# EAGLE design Picobot_14 (EAGLE 6.5.0)
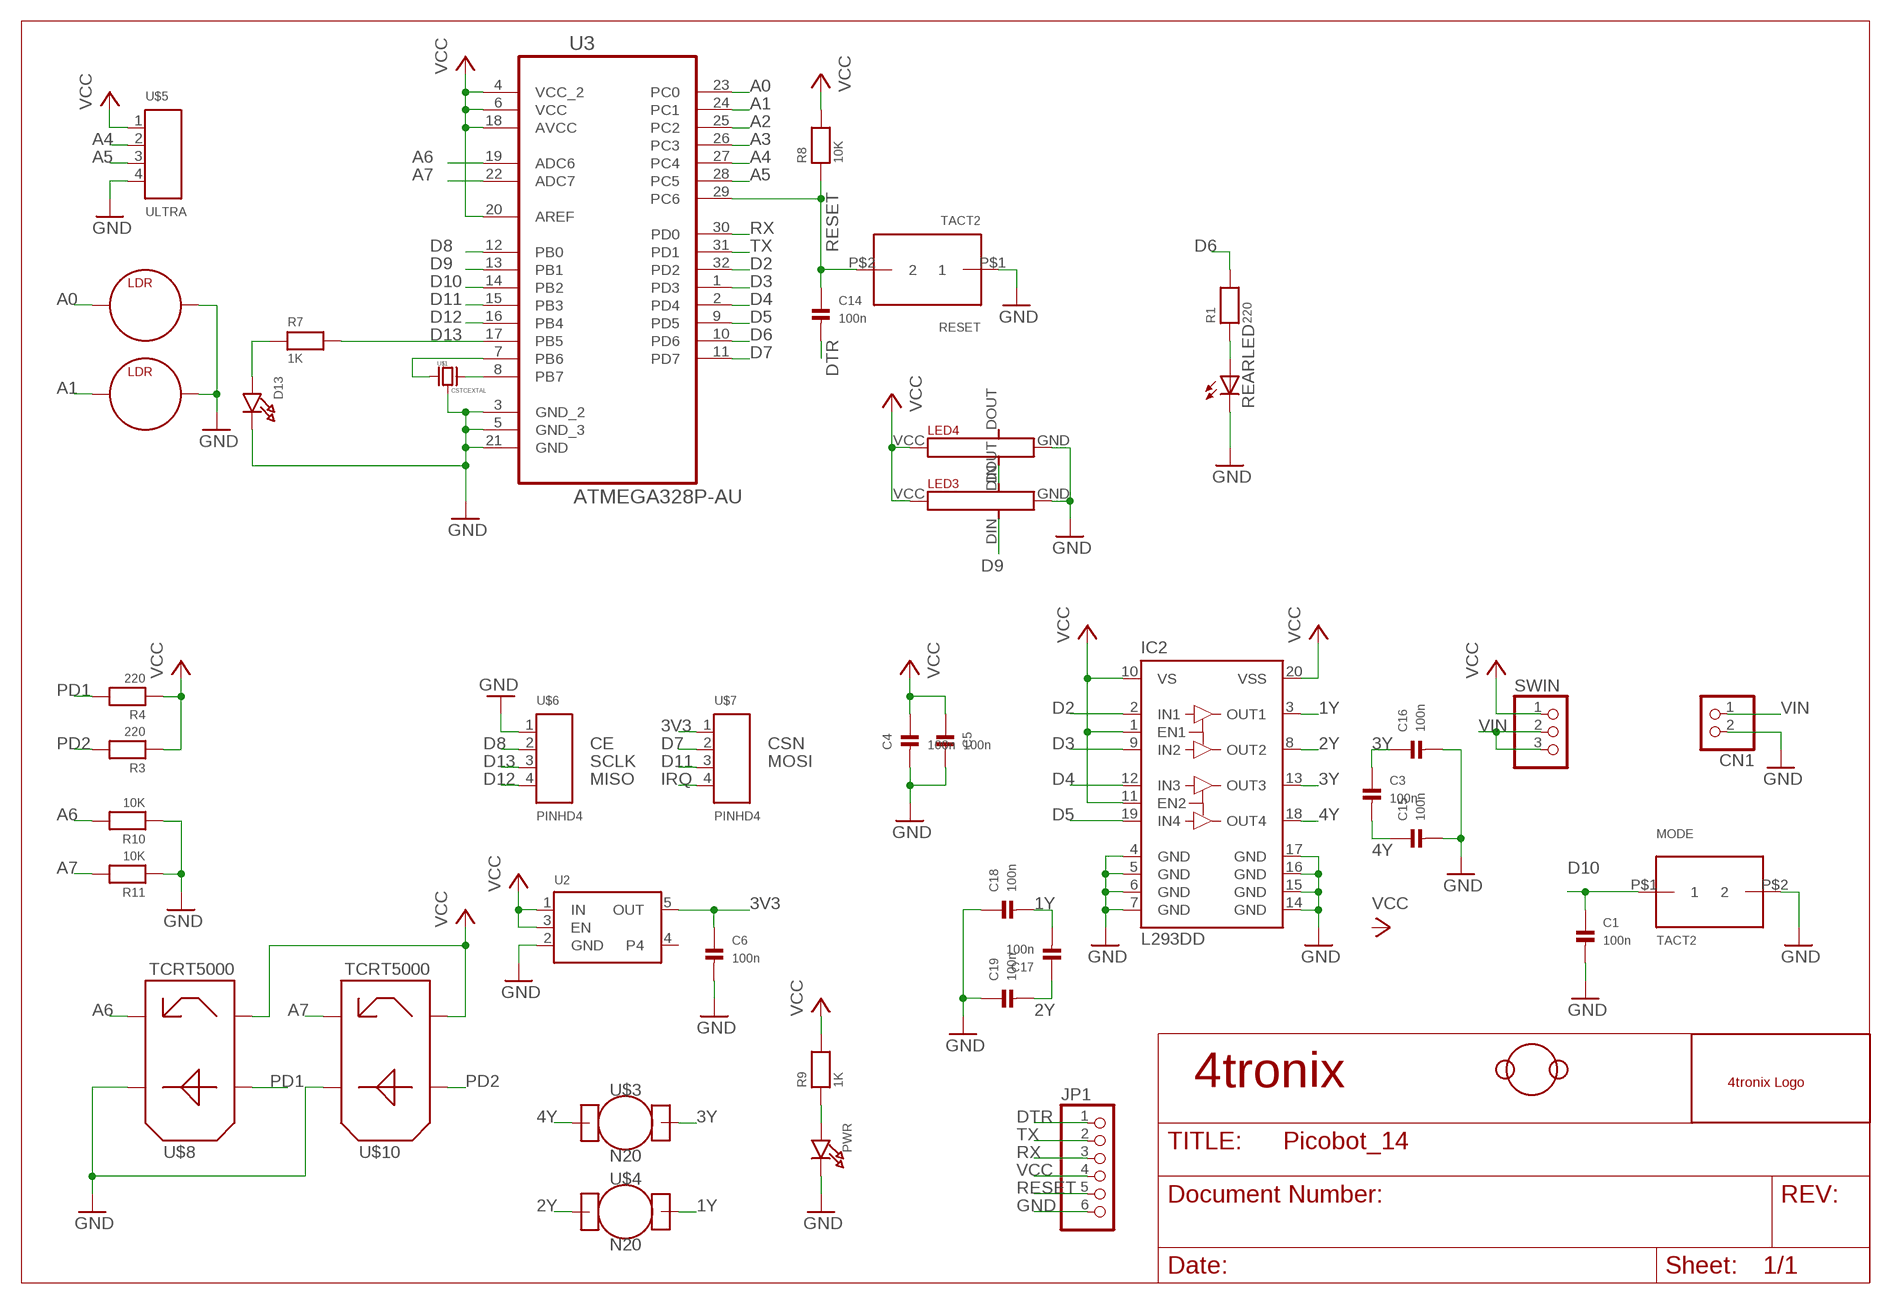
[diagram p0: schematic, sheet 1]

## Parts
C1  100n  CAP_CERAMIC_0603MP  [_0603MP]
C3  100n  CAP_CERAMIC_0603MP  [_0603MP]
C4  100n  CAP_CERAMIC_0603MP  [_0603MP]
C5  100n  CAP_CERAMIC_0603MP  [_0603MP]
C6  100n  CAP_CERAMIC_0603MP  [_0603MP]
C14  100n  CAP_CERAMIC_0603MP  [_0603MP]
C15  100n  CAP_CERAMIC_0603MP  [_0603MP]
C16  100n  CAP_CERAMIC_0603MP  [_0603MP]
C17  100n  CAP_CERAMIC_0603MP  [_0603MP]
C18  100n  CAP_CERAMIC_0603MP  [_0603MP]
C19  100n  CAP_CERAMIC_0603MP  [_0603MP]
CN1  JST_2PIN-THM  [JST-PH-2-THM]
D13  LED0805_NOOUTLINE  [CHIPLED_0805_NOOUTLINE]
IC2  L293DD  [SO20]
JP1  PINHD-1X6CB  [1X06-CLEANBIG]
LDR1  LDR  [LDR]
LDR2  LDR  [LDR]
LED3  WS2812B  [WS2812B]
LED4  WS2812B  [WS2812B]
MODE  TACT2  [TACT2-PIN]
PWR  LED0805_NOOUTLINE  [CHIPLED_0805_NOOUTLINE]
R1  220  RESISTOR0603MINI  [0603-MINI]
R3  220  RESISTOR0603MINI  [0603-MINI]
R4  220  RESISTOR0603MINI  [0603-MINI]
R7  1K  RESISTOR0603MINI  [0603-MINI]
R8  10K  RESISTOR0603MINI  [0603-MINI]
R9  1K  RESISTOR0603MINI  [0603-MINI]
R10  10K  RESISTOR0603MINI  [0603-MINI]
R11  10K  RESISTOR0603MINI  [0603-MINI]
REARLED  LED3MM  [LED3MM]
RESET  TACT2  [TACT2-PIN]
SWIN  PINHD-1X3CB  [1X03-CLEANBIG]
U2  VREG_SOT23-5  [SOT23-5]
U3  ATMEGA328P-AU  [QFP80P900X900X120-32N]
U$1  CSTCEXTAL  [CSTCEXTAL]
U$2  LOGO  [LOGO]
U$3  N20  [N20]
U$4  N20  [N20]
U$5  ULTRA  PINHD4  [PINHD4]
U$6  PINHD4  [PINHD4]
U$7  PINHD4  [PINHD4]
U$8  TCRT5000  [TCRT5000]
U$9  DFRBALL  [DFRBALL]
U$10  TCRT5000  [TCRT5000]

## Nets
1Y: C17.2 C18.2 IC2.3(OUT1) U$4.MTRA(MTRB)
2Y: C17.1 C19.2 IC2.8(OUT2) U$4.MTRB(MTRA)
3V3: C6.1 U2.5(OUT) U$7.1
3Y: C3.1 C16.1 IC2.13(OUT3) U$3.MTRA(MTRB)
4Y: C3.2 C15.1 IC2.18(OUT4) U$3.MTRB(MTRA)
A0: LDR1.A U3.23(PC0)
A1: LDR2.A U3.24(PC1)
A2: U3.25(PC2)
A3: U3.26(PC3)
A4: U3.27(PC4) U$5.2
A5: U3.28(PC5) U$5.3
A6: R10.2 U3.19(ADC6) U$8.TR2
A7: R11.2 U3.22(ADC7) U$10.TR2
D2: IC2.2(IN1) U3.32(PD2)
D3: IC2.9(IN2) U3.1(PD3)
D4: IC2.12(IN3) U3.2(PD4)
D5: IC2.19(IN4) U3.9(PD5)
D6: R1.2 U3.10(PD6)
D7: U3.11(PD7) U$7.2
D8: U3.12(PB0) U$6.2
D9: LED3.DIN(DI) U3.13(PB1)
D10: C1.1 MODE.P$1 U3.14(PB2)
D11: U3.15(PB3) U$7.3
D12: U3.16(PB4) U$6.4
D13: R7.2 U3.17(PB5) U$6.3
DTR: C14.2 JP1.1
GND: C1.2 C4.2 C5.2 C6.2 C15.2 C16.2 C18.1 C19.1 CN1.2 D13.C IC2.4(GND) IC2.5(GND) IC2.6(GND) IC2.7(GND) IC2.14(GND) IC2.15(GND) IC2.16(GND) IC2.17(GND) JP1.6 LDR1.K LDR2.K LED3.GND LED4.GND MODE.P$2 PWR.C R10.1 R11.1 REARLED.K(C) RESET.P$1 U2.2(GND) U3.3(GND_2) U3.5(GND_3) U3.21(GND) U$1.G U$5.4 U$6.1 U$8.LED2 U$10.LED2
IRQ: U$7.4
N$1: D13.A R7.1
N$2: R1.1 REARLED.A
N$3: U3.7(PB6) U$1.X1
N$4: U3.8(PB7) U$1.X2
N$6: LED3.DOUT(DO) LED4.DIN(DI)
N$8: PWR.A R9.1
PD1: R4.2 U$8.LED1
PD2: R3.2 U$10.LED1
RESET: C14.1 JP1.5 R8.1 RESET.P$2 U3.29(PC6)
RX: JP1.3 U3.30(PD0)
TX: JP1.2 U3.31(PD1)
VCC: C4.1 C5.1 IC2.1(EN1) IC2.10(VS) IC2.11(EN2) IC2.20(VSS) JP1.4 LED3.VCC LED4.VCC R3.1 R4.1 R8.2 R9.2 SWIN.1 U2.1(IN) U2.3(EN) U3.4(VCC_2) U3.6(VCC) U3.18(AVCC) U3.20(AREF) U$5.1 U$8.TR1 U$10.TR1
VIN: CN1.1 SWIN.2 SWIN.3
Unconnected: LED4.DOUT(DO) U2.4

## Notes on the sheet
- CE | CSN
- SCLK | MOSI
- MISO
- 4tronix

## Library data of the parts
C1 C3-C6 C14-C19 = microbuilder:CAP_CERAMIC: Ceramic Capacitors 0402 - 0402 Surface Mount Capacitors 16pF 50V 5% [Digikey: 445-4899-2-ND] 18pF 50V 5% [Digikey: 490-1281-2-ND] 22pF 50V 5% [Digikey: 490-1283-2-ND] 68pF 50V 5% [Digikey: 490-1289-2-ND] 0.1uF 10V 10% [Digikey: 490-1318-2-ND] 1.0uF 6.3V 10% [Digikey: 490-1320-2-ND] 0603 - 0603 Surface Mount Capacitors 16 pF 50V 5% [Digikey: 445-5051-2-ND] 22 pF 50V [Digikey: PCC220ACVTR-ND] 33 pF 50V 5% [Digikey: 490-1415-1-ND] 56pF 50V 5% [Digikey: 490-1421-1-ND] 220pF 50V 5% [Digikey: 445-1285-1-ND] 680 pF 50V 2200 pF 50V 5% C0G [Digikey: 445-1297-1-ND] 5600 pF 100V 5% X7R [Digikey: 478-3711-1-ND] 0.1 µF 25V 10% [Digikey: PCC2277TR-ND] 0.22 µF 16V 10% X7R [Digikey: 445-1318-1-ND] 1.0 µF 25V 10% [Digikey: 445-5146-2-ND] 0603 - RF Specific 3pF 250V +/-0.1pF RF [Digikey: 712-1347-1-ND] 18 pF 250V 5% [Digikey: 478-3505-1-ND or 712-1322-1-ND] 56 pF 250V 5% C0G RF [Digikey: 490-4867-1-ND] 68 pF 250V RF [Digikey: 490-4868-1-ND] 0805 - 0805 Surface Mount Capacitors 220 pF 250V 2% RF Ceramic Capacitor [Digikey: 712-1398-1-ND] 1000 pF 50V 2% NP0 Ceramic Capacitor [Digikey: 478-3760-1-ND] 0.1 µF 25V 10% Ceramic Capacitor [Digikey: PCC1828TR-ND] 1.0 µF 16V 10% Ceramic Capacitor[Digikey: 490-1691-2-ND] 10.0 µF 10V 10% Ceramic Capacitor[Digikey: 709-1228-1-ND] 10.0 uF 16V 10% Ceramic Capacitor [Digikey: 478-5165-2-ND] 47 uF 6.3V 20% Ceramic Capacitor [Digikey: 587-1779-1-ND or 399-5506-1-ND] 1206 - 1206 Surface Mount Capacitors 47uF 10V 20% Ceramic Capacitor [Digikey: 490-5528-1-ND or 399-5508-1-ND or 445-6010-1-ND] 100uF 6.3V -20%, +80% Y5V Ceramic Capacitor (Digikey: 490-4512-1-ND, Mouser: 81-GRM31CF50J107ZE1L)
CN1 = adafruit:JST_2PIN: JST 2-Pin Connectors of various flavors SMT-RA (S2B-PH-SM4) 4UConnector #17311 SMT (B2B-PH-SM4) THM-RA (S2B-PH) THM (B2B-PH)
D13 PWR = microbuilder:LED: LED
IC2 = st-microelectronics:L293DD: PUSH-PULL FOUR CHANNEL DRIVER WITH DIODES Source: http://www.st.com/stonline/books/pdf/docs/1330.pdf; OC_FARNELL: unknown
JP1 = adafruit:PINHD-1X6: PIN HEADER
LDR1 LDR2 = 4tronix:LDR
LED3 LED4 = 4tronix:WS2812B: Features and Benefits  * Intelligent reverse connect protection, the power supply reverse connection does not damage the IC. * The control circuit and the LED share the only power source. Control circuit and RGB chip are integrated in a package of 5050 components, form a complete control of pixel point.  * Built-in signal reshaping circuit, after wave reshaping to the next driver, ensure wave-form distortion not accumulate.  * Built-in electric reset circuit and power lost reset circuit.  * Each pixel of the three primary color can achieve 256 brightness display, completed 16777216 color full color display, and scan frequency not less than 400Hz/s.  * Cascading port transmission signal by single line.  * Any two point the distance more than 5m transmission signal without any increase circuit.  * When the refresh rate is 30fps, cascade number are not less than1024 points.  * Send data at speeds of 800Kbps.  *The color of the light were highly consistent, cost-effective. Applications  Full-color module, Full color soft lights a lamp strip. LED decorative lighting, Indoor/outdoor LED video irregular screen. General description WS2812B is a intelligent control LED light source that the control circuit and RGB chip are integrated in a package of 5050 components. It internal include intelligent digital port data latch and signal reshaping amplification drive circuit. Also include a precision internal oscillator and a 12V voltage programmable constant curre-nt control part, effectively ensuring the pixel point light color height consistent. The data transfer protocol use single NZR communication mode. After the pixel power-on reset, the DIN port receive data from controller, the first pixel collect initial 24bit data then sent to the internal data latch, the other data which reshaping by the internal signal reshaping amplification circuit sent to the next cascade pixel through the DO port. After transmission for each pixel,the signal to reduce 24bit. pixel adopt auto reshaping transmit technology, making the pixel cascade number is not limited the signal transmission, only depend on the speed of signal transmission. LED with low driving voltage, environmental protection and energy saving, high brightness, scattering angle is large, good consistency, low power, long life and other advantages. The control chip integrated in LED above becoming more simple circuit, small volume, convenient installation. Absolute Maximum Ratings Power supply voltage: VDD +3.5V..+5.3V Input voltage: VI -0.5V..VDD+0.5V based on WS2812 from https://github.com/adafruit/Adafruit-Eagle-Library
MODE RESET = 4tronix:TACT2
R1 R3 R4 R7-R11 = microbuilder:RESISTOR: Resistors 0402 - 0402 Surface Mount Package 22 Ohm 1% 1/16W [Digikey: 311-22.0LRTR-ND] 33 Ohm 5% 1/16W 1.0K 5% 1/16W 1.5K 5% 1/16W 2.0K 1% 1/16W 10.0K 1% 1/16W [Digikey: 311-10.0KLRTR-ND] 10.0K 5% 1/16W [Digikey: RMCF0402JT10K0TR-ND] 12.1K 1% 1/16W [Digikey: 311-22.0LRTR-ND] 100.0K 5% 1/16W 0603 - 0603 Surface Mount Package 0 Ohm 1/10 Watt 1% Resistor 15 Ohm 1/10 Watt 1% Resistor 33 Ohm 1/10 Watt 1% Resistor 49.9 Ohm 1/10 Watt 1% Resistor 100 Ohm 1/10 Watt 1% Resistor 150 Ohm 1/10 Watt 1% Resistor 240 Ohm 1/10 Watt 1% Resistor 390 Ohm 1/10 Watt 1% Resistor 560 Ohm 1/10 Watt 1% Resistor 680 Ohm 1/10 Watt 1% Resistor 750 Ohm 1/10 Watt 1% Resistor 1.0K Ohm 1/10 Watt 1% Resistor 1.5K Ohm 1/10 Watt 1% Resistor 2.0K Ohm 1/10 Watt 1% Resistor 2.2K Ohm 1/10 Watt 1% Resistor 3.3K Ohm 1/10 Watt 1% Resistor 4.7K Ohm 1/10 Watt 1% Resistor 10.0K Ohm 1/10 Watt 1% Resistor 12.0K Ohm 1/10 Watt 1% Resistor 12.1K Ohm 1/10 Watt 1% Resistor 20.0K Ohm 1/10 Watt 1% Resistor 33.0K Ohm 1/10 Watt 1% Resistor 100.0K Ohm 1/10 Watt 1% Resistor 0805 - 0805 Surface Mount Package 0 Ohm 1/8 Watt 1% Resistor 33 Ohm 1/8 Watt 1% Resistor 100 Ohm 1/8 Watt 1% Resistor 150 Ohm 1/8 Watt 1% Resistor 200 Ohm 1/8 Watt 1% Resistor 240 Ohm 1/8 Watt 1% Resistor 330 Ohm 1/8 Watt 1% Resistor 390 Ohm 1/8 Watt 1% Resistor 470 Ohm 1/8 Watt 1% Resistor 1.0K Ohm 1/8 Watt 1% Resistor 1.5K Ohm 1/8 Watt 1% Resistor 2.0K Ohm 1/8 Watt 1% Resistor 4.7K Ohm 1/8 Watt 1% Resistor 5.1K Ohm 1/8 Watt 1% Resistor 5.6K Ohm 1/8 Watt 1% Resistor 10.0K Ohm 1/8 Watt 1% Resistor 22.0K Ohm 1/8 Watt 1% Resistor 33.0K Ohm 1/8 Watt 1% Resistor 100K Ohm 1/8 Watt 1% Resistor 1206 - 1206 Surface Mount Package 2012 - 2010 Surface Mount Package 0.11 Ohm 1/2 Watt 1% Resistor - Digikey: RHM.11UCT-ND
REARLED = adafruit:LED: LED
SWIN = adafruit:PINHD-1X3: PIN HEADER
U2 = microbuilder:VREG_SOT23-5: SOT23-5 Fixed Voltage Regulators To better organise some of the SOT23-5 fixed voltage regulators in this library, this new part was created. Part Current Out V Out V In V Dropout Digikey Part No. ADP121 150mA 3.3V 3.4-5.5V 0.09V @ 150mA ADP121-AUJZ33R7CT-ND ADP121 150mA 3.0V 3.1-5.5V 0.09V @ 150mA ADP121-AUJZ30R7CT-ND ADP122 300mA 3.3V 3.4-5.5V 0.085V @ 300mA ADP122AUJZ-3.3-R7CT-ND ADP1712 300mA 3.3V 3.5-5.5V 0.17V @ 300mA ADP1712AUJZ-3.3-R7TR-ND AP7311 (Low Cost) 150mA 3.3V 3.5-6V 0.15V @ 150mA AP7311-33WG-7DICT-ND LD39015M18R 150mA 1.8V 1.9V-5.5V 0.08V @ 100mA 497-6977-1-ND MCP1824T-3302E/OT 300mA 3.3V 3.5V-6V 0.2V @ 300mA MCP1824T-3302E/OTCT-ND MIC5205-2.5YM5 TR 150mA 2.5V 2.7-16V 0.165V @ 150mA 576-1257-2-ND MIC5205-3.0YM5 TR 150mA 3.0V 3.2V-16V 0.165V @ 150mA 576-1258-2-ND MIC5205-3.3YM5 TR 150mA 3.3V 3.5V-16V 0.165V @ 150mA 576-1259-2-ND TPS780330220 150mA 3.3V+2.2V 3.6-5.5V 250mV Max 296-23332-1-ND TDA3663/N1,135 100mA 3.3V 3.5-45V 0.18V @ 50mA 568-5343-1-ND
U3 = Atmel_By_element14_Batch_1-00:ATMEGA328P-AU: 8-bit Microcontroller with In-System Programmable Flash; MPN: ATMEGA328P-AU; OC_FARNELL: 1715486; OC_NEWARK: 14R4631; PACKAGE: TQFP-32; SUPPLIER: Atmel
U$1 = 4tronix:CSTCEXTAL
U$2 = 4tronix:LOGO
U$3 U$4 = 4tronix:N20
U$5-U$7 = 4tronix:PINHD4
U$8 U$10 = 4tronix:TCRT5000
U$9 = 4tronix:DFRBALL

## Board
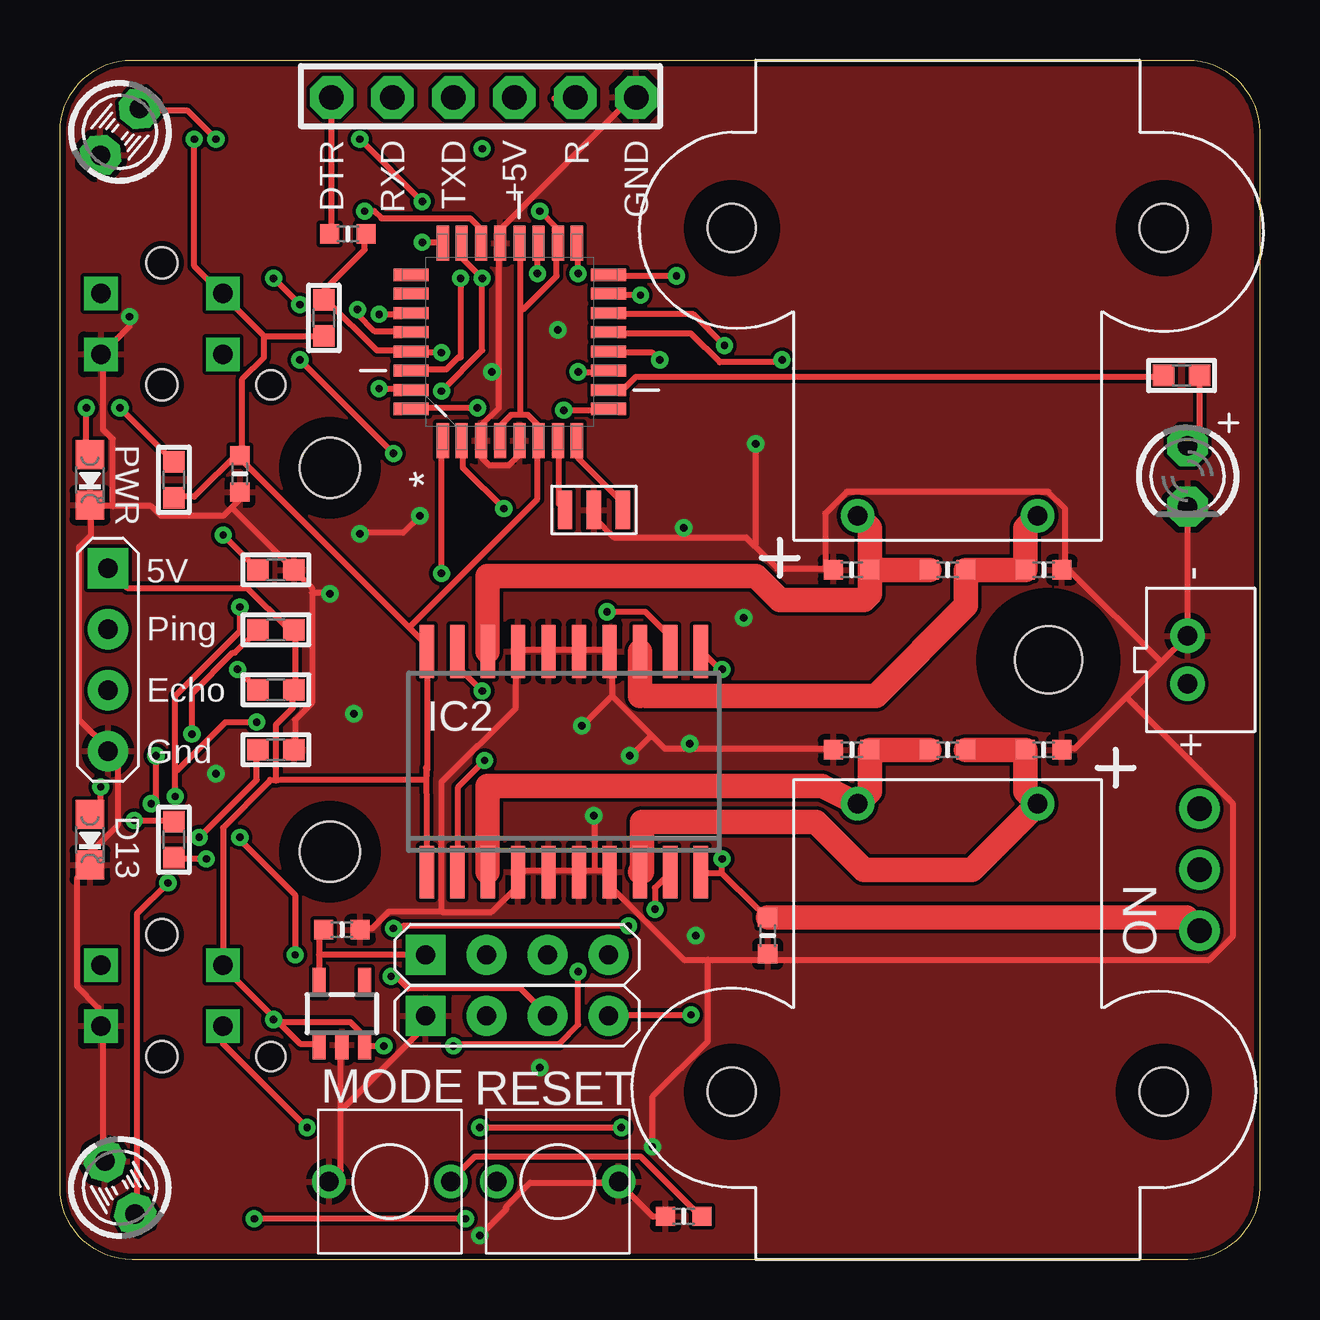
[diagram p1: board, top side]
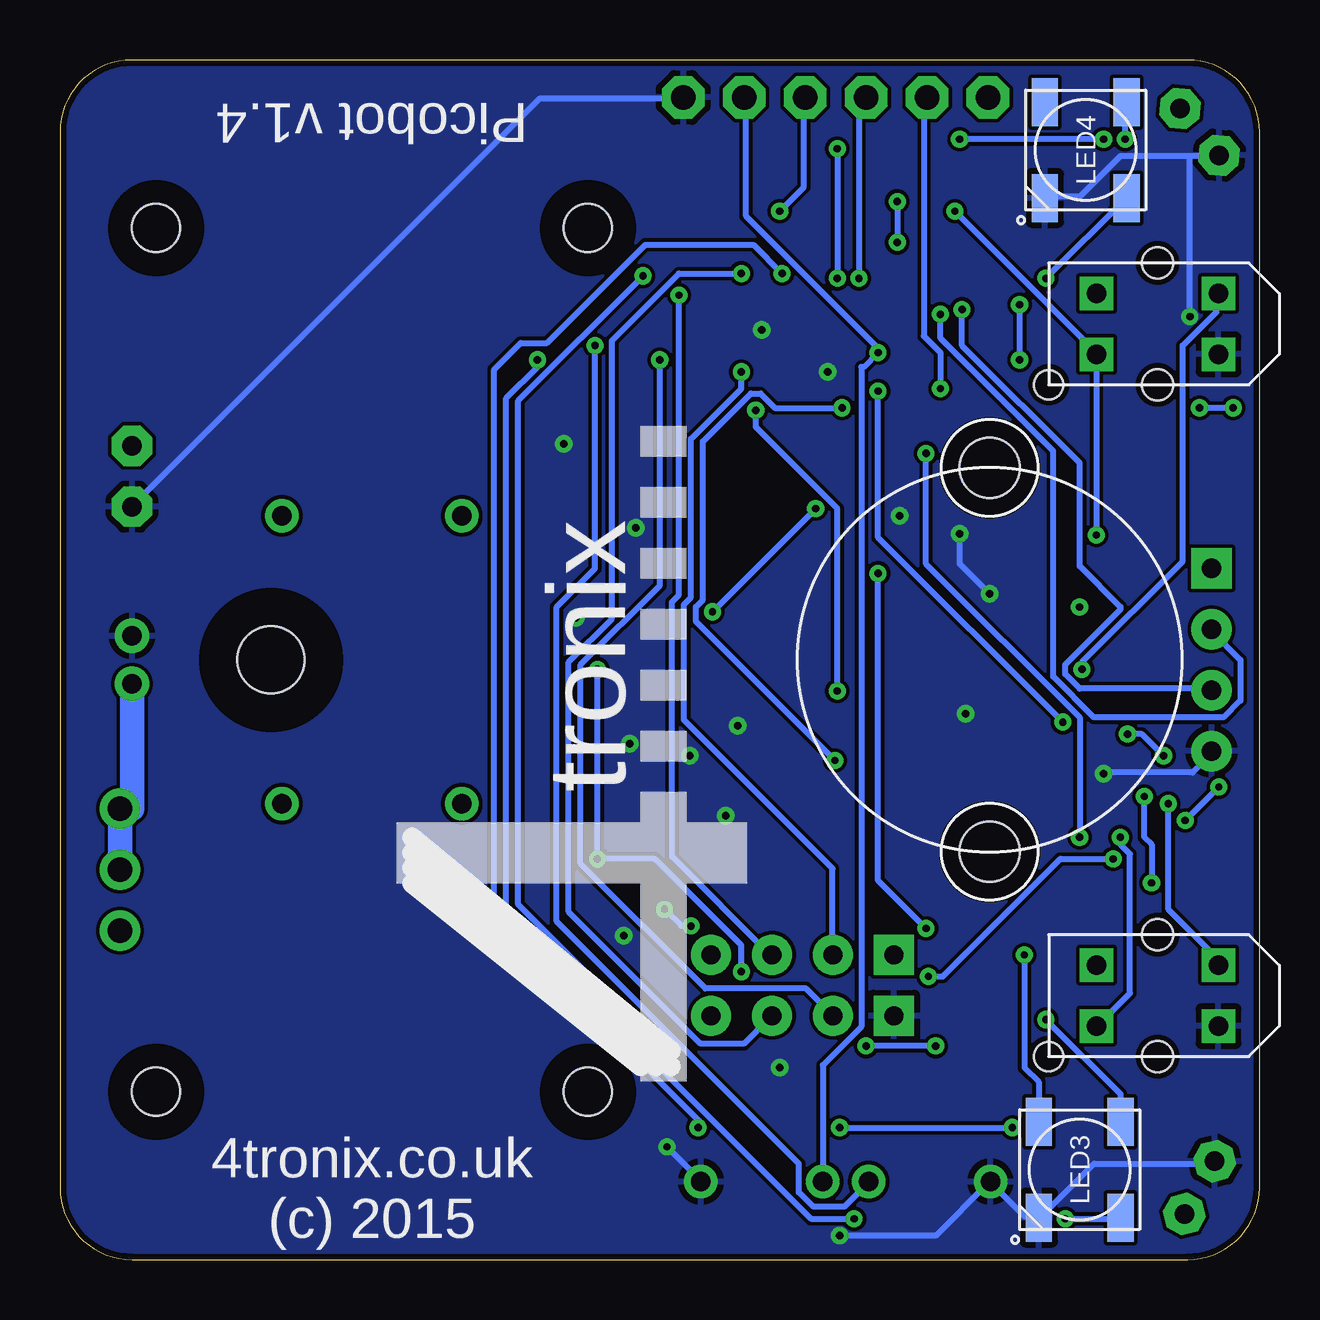
[diagram p2: board, bottom side, seen from below]

Size 50 x 50 mm. Coordinates in mm from the lower left corner, seen from the top.
Outline: 0,3 0,47 arc-90 3,50 47,50 arc-90 50,47 50,3 arc-90 47,0 3,0 arc-90 0,3
Copper layers (1*16): Top 0.035mm / dielectric 1.5mm / Bottom 0.035mm
Design rules "DFRobot_Eagle_Rule_v0.4 *": minimum track width 10mil, minimum drill 12mil, track to track 6mil, track to pad 6mil, pad to pad 6mil, via to via 6mil, smd to smd 0mil, copper to edge 10mil, drill to drill 10mil, minimum pad ring 12mil, minimum via ring 8mil, stop-mask expansion 2mil, vias tented up to drill 25mil, thermal gap 10mil
Holes 2.8 mm at 41.2,25
tRestrict: area 39.2,23 to 43.2,27; area 9.7,15.4 to 12.8,18.6; area 9.7,31.4 to 12.8,34.6
bRestrict: area 39.2,23 to 43.2,27; area 9.7,15.4 to 12.8,18.6; area 9.7,31.4 to 12.8,34.6

### Footprints (pad centres in the part's own frame; a part is rotated, then mirrored left to right if it is on the bottom)
_0603MP = smd 0.8 x 0.8: 1 -0.762,0; 2 0.762,0
JST-PH-2-THM = drill 0.8 pad 1.422: 1 1,0; 2 -1,0
CHIPLED_0805_NOOUTLINE = smd 1.2 x 1.2: A 0,-1.05; C 0,1.05
SO20 = smd 0.6 x 2.2: 1 -5.715,-4.6; 2 -4.445,-4.6; 3 -3.175,-4.6; 4 -1.905,-4.6; 5 -0.635,-4.6; 6 0.635,-4.6; 7 1.905,-4.6; 8 3.175,-4.6; 9 4.445,-4.6; 10 5.715,-4.6; 11 5.715,4.6; 12 4.445,4.6; 13 3.175,4.6; 14 1.905,4.6; 15 0.635,4.6; 16 -0.635,4.6; 17 -1.905,4.6; 18 -3.175,4.6; 19 -4.445,4.6; 20 -5.715,4.6
1X06-CLEANBIG = drill 1.016 pad 1.778 octagon: 1 -6.35,0; 2 -3.81,0; 3 -1.27,0; 4 1.27,0; 5 3.81,0; 6 6.35,0
LDR = drill 0.813 pad 1.676 octagon: A -1.27,0; K 1.27,0
WS2812B = smd 2 x 1.1: DIN 2,1.7; DOUT -2,-1.7; GND 2,-1.7; VCC -2,1.7
TACT2-PIN = drill 0.8: P$1 -2.54,0; P$2 2.54,0
0603-MINI = smd 0.9 x 0.9: 1 -0.75,0; 2 0.75,0
LED3MM = drill 0.813 pad 1.676 octagon: A -1.27,0; K 1.27,0
1X03-CLEANBIG = drill 1.016 pad 1.676: 1 -2.54,0; 2 0,0; 3 2.54,0
SOT23-5 = smd 0.55 x 1.2: 1 -0.95,-1.3; 2 0,-1.3; 3 0.95,-1.3; 4 0.95,1.3; 5 -0.95,1.3
QFP80P900X900X120-32N = smd 1.473 x 0.508: 1 -4.115,2.794; 2 -4.115,2.007; 3 -4.115,1.194; 4 -4.115,0.406; 5 -4.115,-0.406; 6 -4.115,-1.194; 7 -4.115,-2.007; 8 -4.115,-2.794; 17 4.115,-2.794; 18 4.115,-2.007; 19 4.115,-1.194; 20 4.115,-0.406; 21 4.115,0.406; 22 4.115,1.194; 23 4.115,2.007; 24 4.115,2.794 | smd 0.508 x 1.473: 9 -2.794,-4.115; 10 -2.007,-4.115; 11 -1.194,-4.115; 12 -0.406,-4.115; 13 0.406,-4.115; 14 1.194,-4.115; 15 2.007,-4.115; 16 2.794,-4.115; 25 2.794,4.115; 26 2.007,4.115; 27 1.194,4.115; 28 0.406,4.115; 29 -0.406,4.115; 30 -1.194,4.115; 31 -2.007,4.115; 32 -2.794,4.115
CSTCEXTAL = smd 0.6 x 1.6: G 0,0; X1 -1.2,0; X2 1.2,0
N20 = drill 0.8: MTRA 3.75,-12; MTRB -3.75,-12 | hole 2: -9,0; 9,0
PINHD4 = drill 0.8 pad 1.676 square: 1 0,3.81 | drill 0.8 pad 1.676: 2 0,1.27; 3 0,-1.27; 4 0,-3.81
TCRT5000 = drill 0.8 square: LED1 2.54,1.27; LED2 2.54,-1.27; TR1 -2.54,1.27; TR2 -2.54,-1.27 | hole 1.3: 0,2.54; 0,-2.54 | hole 1.2: -4.54,-2.54
DFRBALL = hole 2.5: -8,0; 8,0

### Placement (x,y rotation side)
C1  26,1.8 180 top
C3  37,28.75 180 top
C4  29.5,13.5 270 top
C5  7.5,32.75 270 top
C6  11.75,13.75 0 top
C14  12,42.75 180 top
C15  33,28.75 180 top
C16  41,28.75 0 top
C17  37,21.25 180 top
C18  33,21.25 0 top
C19  41,21.25 180 top
CN1  47,25 270 top
D13  1.25,17.5 180 top
IC2  21,20.75 0 top
JP1  17.67,48.44 0 top
LDR1  2.5,3 120 top
LDR2  2.5,47 230 top
LED3  7.5,3.75 270 bottom
LED4  7.25,46.25 270 bottom
MODE  13.75,3.25 180 top
PWR  1.25,32.5 180 top
R1  46.75,36.85 180 top
R3  9,23.75 180 top
R4  9,26.25 180 top
R7  4.75,17.5 270 top
R8  11,39.25 270 top
R9  4.75,32.5 270 top
R10  9,21.25 180 top
R11  9,28.75 180 top
REARLED  47,32.65 270 top
RESET  20.75,3.25 180 top
SWIN  47.5,16.25 90 top
U2  11.75,10.25 0 top
U3  18.75,38.25 90 top
U$1  22.25,31.25 0 top
U$2  25.8,23.3 90 bottom
U$3  37,43 0 top
U$4  37,7 180 top
U$5  2,25 0 top
U$6  19.05,10.16 90 top
U$7  19.05,12.7 90 top
U$8  4.25,11 0 bottom
U$9  11.25,25 90 bottom
U$10  4.25,39 0 bottom

### Tracks (layer width: path | path; a pad name or v marks a point on that pad's centre or on a via)
1Y
  Top 1.016: IC2.3 17.82,19.75 31.75,19.75 U$4.MTRA 33.76,19.51 C18.2 C17.2
2Y
  Top 1.016: IC2.8 24.25,16.15 24.25,18.25 31.5,18.25 33.5,16.25 38,16.25 U$4.MTRB 40.24,19.51 C19.2 C17.1
3V3
  Top 0.254: 10.8,12.7 10.8,13.7 C6.1 | 10.8,12.7 U2.5 | U$7.1 10.8,12.7
  Bottom 0.254: 15,12.5 15.2,12.7 U$7.1
3Y
  Top 1.016: IC2.13 24.18,23.75 | 24.18,23.75 24.18,23.5 | 24.18,23.75 24.43,23.5 34,23.5 37.76,27.26 C3.1 C16.1 40.24,30.49 U$3.MTRA
4Y
  Top 1.016: IC2.18 17.82,28.5 29,28.5 30,27.5 33.5,27.5 33.75,27.75 33.75,28.74 C15.1 | C15.1 C3.2 | U$3.MTRB 33.76,30.49 C15.1
A0  (via drill 0.3)
  Top 0.254: v7.5,27.2 7.5,26.2 4.8,23.5 4.8,20.4 | v4.8,19.3 4.8,20.4 | U3.23 16.8,42.3 16.8,41.7 v17.6,40.9 17.6,37.9 v15.9,36.2 | v8.2,22.4 6.9,22.4 4.9,20.4 4.8,20.4 | v4.5,15.7 3.2,14.4 3.2,2 LDR1.A
  Bottom 0.254: v17.6,46.3 v17.6,40.9 | v4.8,19.3 4.8,17.6 4.5,17.3 v4.5,15.7 | v15.9,36.2 15.9,30.1 v8.2,22.4
A1  (via drill 0.3)
  Top 0.254: v15.1,42.4 15.9,42.4 U3.24 | v12.5,46.7 v15.1,44.1 | v6.5,46.7 5.3,47.9 3.4,47.9 LDR2.A
  Bottom 0.254: v15.1,44.1 v15.1,42.4 | v6.5,46.7 v12.5,46.7
A4  (via drill 0.3)
  Top 0.254: v13.3,39.4 14.6,39.4 U3.27
  Bottom 0.254: U$5.2 2,26.2 0.8,25 0.8,23.3 1.5,22.6 6.9,22.6 8.6,24.3 8.6,33.7 13.3,38.4 v13.3,39.4
A5  (via drill 0.3)
  Top 0.254: v12.4,39.6 12.4,39.4 13.1,38.7 14.6,38.7 U3.28
  Bottom 0.254: U$5.3 2,23.8 7.5,23.8 8.1,24.4 8.1,24.8 5.8,27.1 5.8,27.2 7.5,28.9 7.5,33.2 12.4,38.1 v12.4,39.6
A6  (via drill 0.3)
  Top 0.254: 8.2,21.2 R10.2 8.2,21.1 8.2,20 v5.8,17.6 | v19.9,41.1 19.9,42.3 U3.19 | v10.3,5.5 6.8,9 6.8,9.7 U$8.TR2 | v23.4,5.5 v17.5,5.5
  Bottom 0.254: v19.9,41.1 21.1,42.3 25.6,42.3 29.7,38.2 30.8,38.2 31.9,37.1 31.9,14.3 23.25,5.65 v23.4,5.5 | v5.8,17.6 5.8,17.3 5.4,16.9 5.4,11.1 6.7,9.8 U$8.TR2 | v17.5,5.5 v10.3,5.5
A7  (via drill 0.3)
  Top 0.254: v6.8,30.2 R11.2 | U3.22 17.5,42.4 17.5,43 17.1,43.4 13.4,43.4 13.1,43.7 v12.7,43.7
  Bottom 0.254: v12.7,43.7 6.8,37.8 U$10.TR2 6.8,37.7 v6.8,30.2
D2  (via drill 0.3)
  Top 0.254: v17.4,35.5 14.7,35.5 U3.32 | v17.7,20.8 16.6,19.7 16.6,16.2 IC2.2
  Bottom 0.254: v17.4,35.5 20.2,35.5 20.8,36.1 21.2,36.1 23.2,34.1 23.2,27.5 23.5,27.2 23.5,26.6 v17.7,20.8
D3  (via drill 0.3)
  Top 0.254: v15.9,28.6 15.9,34.1 U3.1 | v13.9,13.8 14.2,13.8 14.3,13.9 v23.7,13.9 | v24.8,14.6 24.8,15.5 25.4,16.1 IC2.9
  Bottom 0.254: v15.9,28.6 15.9,15.8 v13.9,13.8 | v23.7,13.9 24.1,13.9 v24.8,14.6
D4  (via drill 0.3)
  Top 0.254: v18.5,31.3 16.8,33 16.8,34.1 U3.2 | v22.8,27 24.4,27 25.4,26 25.4,25.4 IC2.12
  Bottom 0.254: v22.8,27 v18.5,31.3
D5  (via drill 0.3)
  Top 0.254: v21,35.4 22.8,35.4 U3.9 | v17.6,23.7 16.6,24.7 16.6,25.3 IC2.19
  Bottom 0.254: v21,35.4 21,34.7 17.6,31.3 v17.6,23.7
D6
  Top 0.254: R1.2 46,36.8 24,36.8 23.5,36.3 22.9,36.3 U3.10
D7  (via drill 0.3)
  Top 0.254: v21.6,37 22.8,37 U3.11
  Bottom 0.254: v21.6,37 21.6,36.3 23.7,34.2 23.7,27.6 24,27.3 24,22.5 17.8,16.3 17.8,12.7 U$7.2
D8  (via drill 0.3)
  Top 0.254: v25,37.5 24.7,37.8 22.9,37.8 U3.12
  Bottom 0.254: v25,37.5 25,28.1 28.3,24.8 28.3,16.5 23.1,11.3 18.9,11.3 17.8,10.2 U$6.2
D9  (via drill 0.3)
  Top 0.254: v30.1,37.5 30,37.4 27.5,37.4 26.3,38.6 22.9,38.6 U3.13 | v16.9,1.7 v8.1,1.7
  Bottom 0.254: v30.1,37.5 30.1,37.2 31.4,35.9 31.4,14.4 18.7,1.7 v16.9,1.7 | v8.1,1.7 5.8,1.7 LED3.DIN
D10  (via drill 0.3)
  Top 0.254: C1.1 26.7,1.8 24.2,4.3 17.3,4.3 16.3,3.3 MODE.P$1 | v27.7,38.1 26.4,39.4 22.9,39.4 U3.14
  Bottom 0.254: v27.7,38.1 27.7,28.8 29.3,27.2 29.3,14.1 19.2,4 19.2,2.8 18.6,2.2 17.3,2.2 16.3,3.2 MODE.P$1
D11  (via drill 0.3)
  Top 0.254: v24.2,40.2 22.9,40.2 U3.15
  Bottom 0.254: v24.2,40.2 24.2,27.7 24.5,27.4 24.5,16.8 20.4,12.7 U$7.3
D12  (via drill 0.3)
  Top 0.254: v25.7,41 22.9,41 U3.16 | v26.3,10.2 22.9,10.2 U$6.4
  Bottom 0.254: v25.7,41 30.9,35.8 30.9,14.8 v26.3,10.2
D13  (via drill 0.3)
  Top 0.254: v13.8,11.8 14,11.8 14.5,11.3 19.2,11.3 20.3,10.2 U$6.3 | v21.6,41.1 21.6,42.3 U3.17 | v6.1,16.7 4.8,16.7 R7.2
  Bottom 0.254: v21.6,41.1 24.2,41.1 27,38.3 27,26.7 28.8,24.9 28.8,14.5 23.3,9 21.5,9 20.4,10.1 U$6.3 | v6.1,16.7 8.3,16.7 13.2,11.8 v13.8,11.8
DTR
  Top 0.254: C14.2 11.3,42.8 11.3,48.4 JP1.1
GND  (via drill 0.3)
  Top 0.254: U3.5 19.1,34.1 19.1,33.5 18.7,33.1 17.9,33.1 17.6,33.4 17.6,34.1 U3.3 17.6,34.2 17.6,34.8 18.3,35.5 18.3,42.3 U3.21 18.4,42.4 18.4,43 23.8,48.4 24,48.4 JP1.6 | 28.95,29.75 28.6,30.1 26,30.1 | 28.95,29.75 29.9,28.8 31.9,28.8 C15.2 31.9,28.9 31.9,31.1 32.8,32 41.2,32 41.9,31.3 41.9,28.8 C16.2 42.1,28.7 45.9,24.9 | 26,30.1 23.1,30.1 22.3,30.9 22.3,31.2 U$1.G | 45.9,24.9 CN1.2 REARLED.K | 45.9,24.9 44.45,23.45 | 44.45,23.45 42.3,21.3 42.1,21.3 C19.1 | 10.5,27.8 10.5,28 R11.1 7.2,31.3 C5.2 7.5,31.7 6.8,31 4.2,31 3.8,31.4 2.2,31.4 | 10.5,27.8 10.5,23.2 9.8,22.5 9.8,21.3 R10.1 | 2.2,31.4 1.3,31.4 PWR.C 1.3,31.3 1.3,30.2 0.8,29.7 0.8,22.5 2,21.3 U$5.4 2,21.1 2.4,20.7 2.4,18.1 1.3,17 1.3,16.5 D13.C 0.7,15.9 0.7,11.4 1.6,10.5 1.6,9.8 U$8.LED2 1.8,9.7 1.8,4.1 LDR1.K | 2.2,31.4 2.2,34.2 1.8,34.6 1.8,37.7 U$10.LED2 1.8,37.8 2.9,38.9 v2.9,39.3 | 19.1,25.4 IC2.17 | IC2.17 19.2,25.4 20.3,25.4 IC2.16 | 20.4,25.4 IC2.16 | 21.7,25.4 IC2.15 | 26.3,21.3 25.2,21.3 24.65,21.85 | 26.3,21.3 31.9,21.3 C18.1 | 23,23.5 24.65,21.85 | 23,23.5 23,25.3 IC2.14 | IC2.15 21.8,25.4 22.8,25.4 IC2.14 | 23,25.4 IC2.14 | IC2.16 20.5,25.4 21.6,25.4 IC2.15 | 19.1,16.2 IC2.4 | IC2.4 19.2,16.2 20.3,16.2 IC2.5 | 20.4,16.2 IC2.5 | 21.7,16.2 IC2.6 | 27,12.5 26,12.5 23,15.5 23,16.1 IC2.7 | 27,12.5 29.5,12.5 C4.2 29.6,12.5 47.9,12.5 48.9,13.5 48.9,19 44.45,23.45 | 22.3,16.2 22.8,16.2 IC2.7 | 22.3,16.2 21.8,16.2 IC2.6 | 23,16.2 IC2.7 | IC2.5 20.5,16.2 21.6,16.2 IC2.6 | 15.2,10.2 U$6.1 15.2,10.1 15.2,9.7 11.8,6.3 11.7,6.3 | C1.2 24.7,1.8 23.3,3.2 RESET.P$1 23.2,3.2 19.6,3.2 18.6,2.2 18.6,2.1 v17.5,1 | 15.9,14.5 18,14.5 19,15.5 19,16.1 IC2.4
  Top 0.254: 15.9,14.5 15.9,19.9 19,23 19,25.3 IC2.17 | 22.3,16.2 22.3,18.5 v22.25,18.5 | 24.65,21.85 23.8,21 v23.75,21 | v26.25,21.5 26.3,21.5 26.3,21.3 | 23,23.5 v21.75,22.25 | 26,30.1 v26,30.5 | v29,34 29,29.8 28.95,29.75 | 15.9,14.5 13.7,14.5 13,13.8 12.8,13.8 C6.2 | 11.7,6.3 11.7,3.7 11.3,3.3 MODE.P$2 | 11.7,6.3 11.7,8.9 U2.2 | v15,31 14.3,30.3 12.5,30.3 v12.5,30.25 | 10.5,27.8 11.2,27.8 v11.25,27.75 | 27,12.5 27,9.1 24.7,6.8 v24.7,4.7
  Bottom 0.254: JP1.6 24.1,48.4 30,48.4 47,31.4 REARLED.K | v17.5,1 13.5,1 11.3,3.2 MODE.P$2 11.2,3.2 9.8,1.8 9.2,1.8 LED3.GND 9.1,1.8 6.9,4 1.9,4 LDR1.K | 2.9,46 1.7,46 LDR2.K | 2.9,46 5.8,46 7.5,44.3 8.9,44.3 LED4.GND | v6.5,20.25 6.5,20.3 2.8,20.3 2,21.1 U$5.4 | v12.5,30.25 12.5,29 v11.25,27.75 | v2.9,39.3 2.9,46 | v24.7,4.7 23.3,3.3 RESET.P$1
  other vias: 12.25,22.75 20,8 26.5,13.5 28.5,26.75 18,37 20.75,38.75
  pour Bottom: -1.25,50.75 52.5,50.75 52.5,-0.5 -1.5,-0.5 -1.5,2.25
  pour Top: -1,50.75 51.75,50.75 51.75,-0.5 -1.25,-0.5 -1.25,1.5
N$1  (via drill 0.3)
  Top 0.254: v3.1,18.3 4.7,18.3 R7.1 | v1.7,19.7 1.7,19 D13.A
  Bottom 0.254: v1.7,19.7 v3.1,18.3
N$2
  Top 0.254: R1.1 47.5,34.5 47,34 REARLED.A
N$3
  Top 0.254: U$1.X1 20.8,31.5 20.8,34.1 U3.7
N$4
  Top 0.254: U3.8 21.6,34.1 21.6,33.4 23.4,31.6 23.4,31.3 U$1.X2
N$6  (via drill 0.3)
  Top 0.254: v9.8,12.7 9.8,15.2 7.5,17.5 v7.5,17.6 | v10,39.8 v8.9,40.9 | v13.9,33.6 v10,37.5
  Bottom 0.254: v7.5,17.6 7.5,22.6 13.9,29 v13.9,33.6 | LED3.DOUT 9.2,7.4 9.8,8 v9.8,12.7 | v8.9,40.9 LED4.DIN | v10,37.5 v10,39.8
N$8  (via drill 0.3)
  Top 0.254: v2.5,35.5 R9.1 | v1.1,35.5 1.1,33.7 PWR.A
  Bottom 0.254: v1.1,35.5 v2.5,35.5
PD1  (via drill 0.3)
  Top 0.254: R4.2 7.3,25.3 7.2,25.3 5.5,23.6 v5.5,21.9 | v4,21 4,19.2 v3.8,19
  Bottom 0.254: v5.5,21.9 4.9,21.9 v4,21 | v3.8,19 3.8,14.6 1.8,12.6 1.8,12.3 U$8.LED1
PD2  (via drill 0.3)
  Top 0.254: v7.4,24.6 R3.2
  Bottom 0.254: v7.4,24.6 7.4,24.9 3.2,29.1 3.2,38.1 1.8,39.5 1.8,40.2 U$10.LED1
RESET  (via drill 0.3)
  Top 0.254: 20.6,48.4 21.4,48.4 JP1.5 | v15.9,37.8 14.7,37.8 U3.29 14.6,37.9 13.2,37.9 11.1,40 R8.1 11,40.4 12.7,42.1 12.7,42.7 C14.1
  Bottom 0.254: RESET.P$2 18.2,3.3 18.2,8.1 16.6,9.7 16.6,37.2 16.5,37.2 v15.9,37.8 15.9,38 21.4,43.5 21.4,48.4 JP1.5
RX  (via drill 0.3)
  Top 0.254: v16.7,40.9 16.7,37.6 16.6,37.6 16.1,37.1 14.7,37.1 U3.30
  Bottom 0.254: v16.7,40.9 16.7,48.2 16.4,48.5 JP1.3
TX  (via drill 0.3)
  Top 0.254: v13.3,36.3 14.6,36.3 U3.31
  Bottom 0.254: v13.3,36.3 13.3,37.8 14,38.5 14,48.3 JP1.2
VCC  (via drill 0.3)
  Top 0.254: 27.6,16.1 26.8,16.1 IC2.10 | 27.6,16.1 29,14.7 C4.1 | v27.6,24.6 27.5,24.6 26.8,25.3 IC2.11 | 27.6,16.1 v27.6,16.7 | v21.6,12 21.6,9.8 20.8,9 16.5,9 v16.4,8.9 | 19.2,35.2 19.5,35.2 19.9,34.8 19.9,34.2 U3.6 | 19.2,35.2 18.8,35.2 18.4,34.8 18.4,34.2 U3.4 | 19.9,34.1 U3.6 | 19.2,35.2 19.2,39.6 | 19.2,39.6 19.2,42.3 U3.20 | 19.2,39.6 19.3,39.6 20.7,41 20.7,42.3 U3.18 20.7,42.4 20.7,43 v20,43.7 | U$5.1 2.8,28 7.8,28 9.5,26.3 9.7,26.3 R4.1 9.8,26.2 9.8,23.8 R3.1 9.7,23.7 9.7,23 9,22.3 9,19.95 | 15.3,20.5 15.3,25.3 IC2.20 15.2,25.4 15.2,25.7 14.55,26.35 | 15.3,20.5 15.25,20.5 15.3,16.2 IC2.1 | R9.2 4.8,31.8 5.6,31.8 7.5,33.7 C5.1 | 7.6,33.8 C5.1 | 14.55,26.35 7.4,33.5 C5.1 | 9,19.95 9.2,20 15.25,20 15.3,20.5 | 14.55,26.35 19.9,31.7 19.9,34 U3.6 | 9,19.95 8.75,20 8.7,19.9 6.8,18 6.8,12.3 U$8.TR1 6.8,12.2 8.95,10.05 | 8.5,38.5 R8.2 | 8.5,38.5 6.8,40.2 U$10.TR1 6.7,40.3 5.6,41.4 v5.6,46.7 | 8.95,10.05 9.15,9.85 | 9.15,9.85 10,9 10.8,9 U2.1 | 9.15,9.85 9.2,9.9 12.1,9.9 12.7,9.3 U2.3 12.8,8.9 v13.5,8.9 | v8.9,10 8.95,10.05 | 8.5,38.5 8.5,37.6 7.6,36.7 7.6,33.9 C5.1
  Top 1.016: SWIN.1 46.95,14.26 C4.1
  Bottom 0.254: v27.6,24.6 v27.6,16.7 25.2,16.7 21.6,13.1 v21.6,12 | v20,43.7 19,44.7 19,48.4 JP1.4 | v5.6,46.7 5.6,48.2 LED4.VCC | LED3.VCC 5.8,6.9 v8.9,10 | v13.5,8.9 v16.4,8.9
VIN
  Bottom 1.016: CN1.1 47,18.79 SWIN.3 SWIN.2

### Text on the board
tPlace: DTR | RXD | TXD | +5V | R | GND | 5V | Ping | Echo | Gnd | ON
bPlace: Picobot v1.4 | 4tronix.co.uk / (c) 2015